# EAGLE design OpenProg-18F2550 (EAGLE 7.2.0)
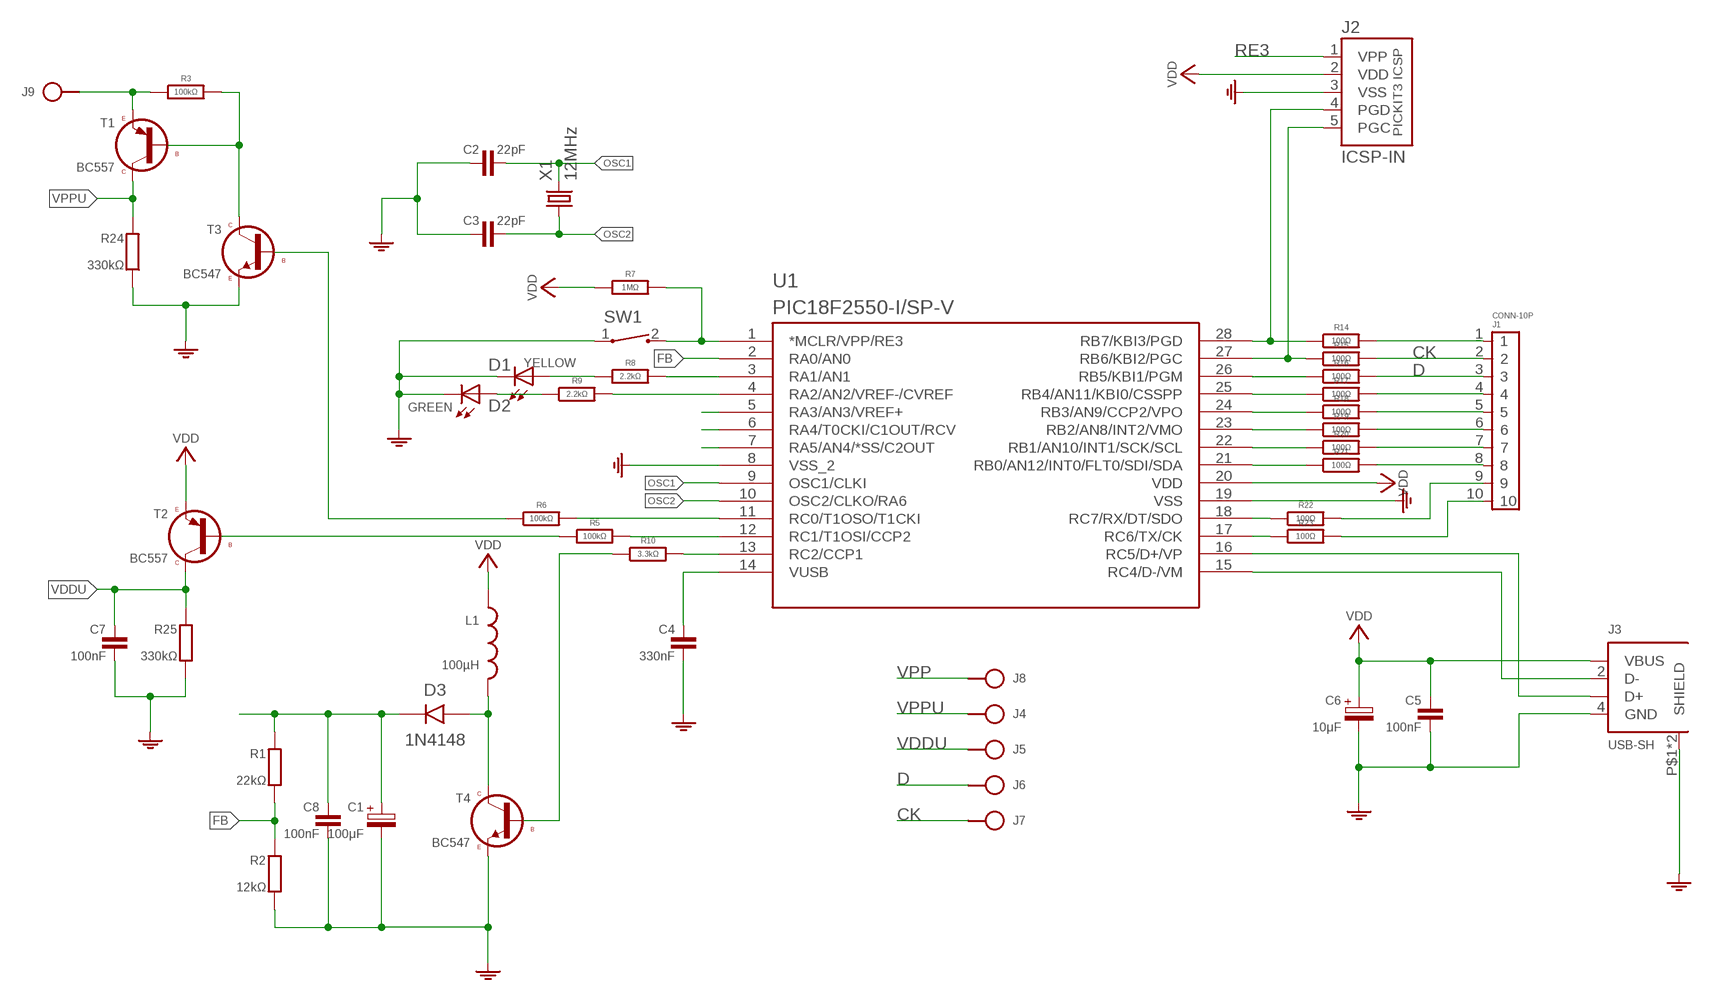
[diagram p0: schematic, sheet 1]

## Parts
C1  100μF  CPOLE5-5  [E5-5]
C2  22pF  C-H025-015X024  [C025-015X024]
C3  22pF  C-H025-015X024  [C025-015X024]
C4  330nF  C050-030X075  [C050-030X075]
C5  100nF  C050-025X075  [C050-025X075]
C6  10μF  CPOLE5-5  [E5-5]
C7  100nF  C050-025X075  [C050-025X075]
C8  100nF  C050-025X075  [C050-025X075]
D1  YELLOW  LED-3MM  [LED_3MM]
D2  GREEN  LED-3MM  [LED_3MM]
D3  1N4148  1N4148-HDO34-7  [DO34-7]
J1  CONN-10P  [CONN-10P]
J2  ICSP-IN  PICKIT3-ICSP-PK3  [PIC-PK3]
J3  USB-SH  [USB-B-PRINT]
J4  HPORT  [SPAD]
J5  HPORT  [SPAD]
J6  HPORT  [SPAD]
J7  HPORT  [SPAD]
J8  HPORT  [SPAD]
J9  HPORT  [SPAD]
L1  100µH  L02/10  [L-03/10V]
R1  22kΩ  R0204/10-V  [0204/10-V]
R2  12kΩ  R0204/10-V  [0204/10-V]
R3  100kΩ  R-H0204/2  [0204/2]
R5  100kΩ  R-H0204/10  [0204/10]
R6  100kΩ  R-H0204/10  [0204/10]
R7  1MΩ  R-H0204/10  [0204/10]
R8  2.2kΩ  R-H0204/10  [0204/10]
R9  2.2kΩ  R-H0204/10  [0204/10]
R10  3.3kΩ  R-H0204/10  [0204/10]
R14  100Ω  R-H0204/10  [0204/10]
R15  100Ω  R-H0204/10  [0204/10]
R16  100Ω  R-H0204/10  [0204/10]
R17  100Ω  R-H0204/10  [0204/10]
R18  100Ω  R-H0204/10  [0204/10]
R19  100Ω  R-H0204/10  [0204/10]
R20  100Ω  R-H0204/10  [0204/10]
R21  100Ω  R-H0204/10  [0204/10]
R22  100Ω  R-H0204/10  [0204/10]
R23  100Ω  R-H0204/10  [0204/10]
R24  330kΩ  R0204/10-V  [0204/10-V]
R25  330kΩ  R0204/10-V  [0204/10-V]
SW1  PUSHBUTTON-P1T  [PB-1P1T]
T1  BC557  BC557CBE-A  [TO92-CBE-A]
T2  BC557  BC557CBE-A  [TO92-CBE-A]
T3  BC547  BC547-A  [TO92-CBE-A]
T4  BC547  BC547-A  [TO92-CBE-A]
U1  PIC18F2550-I/SP-V  [DIL28-3/V]
X1  12MHz  CRYSTALHC49  [HC49]

## Nets
CK: J1.2 J7.1 R15.2
D: J1.3 J6.1 R16.2
FB: R1.2 R2.1 U1.2(RA0/AN0)
GND: C1.- C2.1 C3.1 C4.2 C5.2 C6.- C7.2 C8.2 D1.K(C) D2.K(C) J2.3(VSS) J3.4(GND) J3.P$1(SHIELD) J3.P$2(SHIELD) R2.2 R24.2 R25.2 SW1.1 T3.3(E) T4.3(E) U1.8(VSS_2) U1.19(VSS)
N$2: R10.1 T4.2(B)
N$3: U1.5(RA3/AN3/VREF+)
N$4: U1.6(RA4/T0CKI/C1OUT/RCV)
N$5: D3.A L1.2 T4.1(C)
N$6: U1.7(RA5/AN4/*SS/C2OUT)
N$7: R6.1 T3.2(B)
N$11: R3.2 T1.2(B) T3.1(C)
N$12: R5.1 T2.2(B)
N$13: J2.4(PGD) R14.1 U1.28(RB7/KBI3/PGD)
N$15: J2.5(PGC) R15.1 U1.27(RB6/KBI2/PGC)
N$16: R16.1 U1.26(RB5/KBI1/PGM)
N$17: R17.1 U1.25(RB4/AN11/KBI0/CSSPP)
N$18: R18.1 U1.24(RB3/AN9/CCP2/VPO)
N$19: R19.1 U1.23(RB2/AN8/INT2/VMO)
N$20: R20.1 U1.22(RB1/AN10/INT1/SCK/SCL)
N$21: R21.1 U1.21(RB0/AN12/INT0/FLT0/SDI/SDA)
N$22: J1.1 R14.2
N$25: J1.4 R17.2
N$26: J1.5 R18.2
N$27: J1.6 R19.2
N$28: J1.7 R20.2
N$29: J1.8 R21.2
N$30: R22.1 U1.18(RC7/RX/DT/SDO)
N$31: R23.1 U1.17(RC6/TX/CK)
N$32: J1.9 R22.2
N$33: J1.10 R23.2
N$34: J3.3(D+) U1.16(RC5/D+/VP)
N$35: J3.2(D-) U1.15(RC4/D-/VM)
N$36: C4.1 U1.14(VUSB)
N$39: D1.A R8.1
N$40: D2.A R9.1
OSC1: C2.2 U1.9(OSC1/CLKI) X1.2
OSC2: C3.2 U1.10(OSC2/CLKO/RA6) X1.1
RA1: R8.2 U1.3(RA1/AN1)
RA2: R9.2 U1.4(RA2/AN2/VREF-/CVREF)
RC0: R6.2 U1.11(RC0/T1OSO/T1CKI)
RC1: R5.2 U1.12(RC1/T1OSI/CCP2)
RC2: R10.2 U1.13(RC2/CCP1)
RE3: J2.1(VPP) R7.2 SW1.2 U1.1(*MCLR/VPP/RE3)
VCC: C5.1 C6.+ J2.2(VDD) J3.1(VBUS) L1.1 R7.1 T2.3(E) U1.20(VDD) ; supply symbol labelled VDD
VDDU: C7.1 J5.1 R25.1 T2.1(C)
VPP: C1.+ C8.1 D3.C J8.1 R1.1
VPP2: J9.1 R3.1 T1.3(E)
VPPU: J4.1 R24.1 T1.1(C)

## Library data of the parts
C1 C6 = c:CPOL: POLARIZED CAPACITOR, European symbol
C2 C3 = c:C-H
C4 C5 C7 C8 = c:C: CAPACITOR, European symbol
D1 D2 = d:LED
D3 = d:1N4148-H
J1 = pinconn:CONN-10P
J2 = pinconn:PICKIT3-ICSP
J3 = usb:USB-SH
J4-J9 = pad:HPORT: Conrad Connectors Created by librarian@cadsoft.de
L1 = l:L: Potentiometers Beckman, Copal, Piher, Spectrol, Schukat Created by librarian@cadsoft.de
R1 R2 R24 R25 = r:R: RESISTOR, European symbol
R3 R5-R10 R14-R23 = r:R-H
SW1 = sw:PUSHBUTTON
T1 T2 = t:BC557
T3 T4 = t:BC547
U1 = mcu:PIC18F2550-I/SP
X1 = q:CRYSTAL

## Board
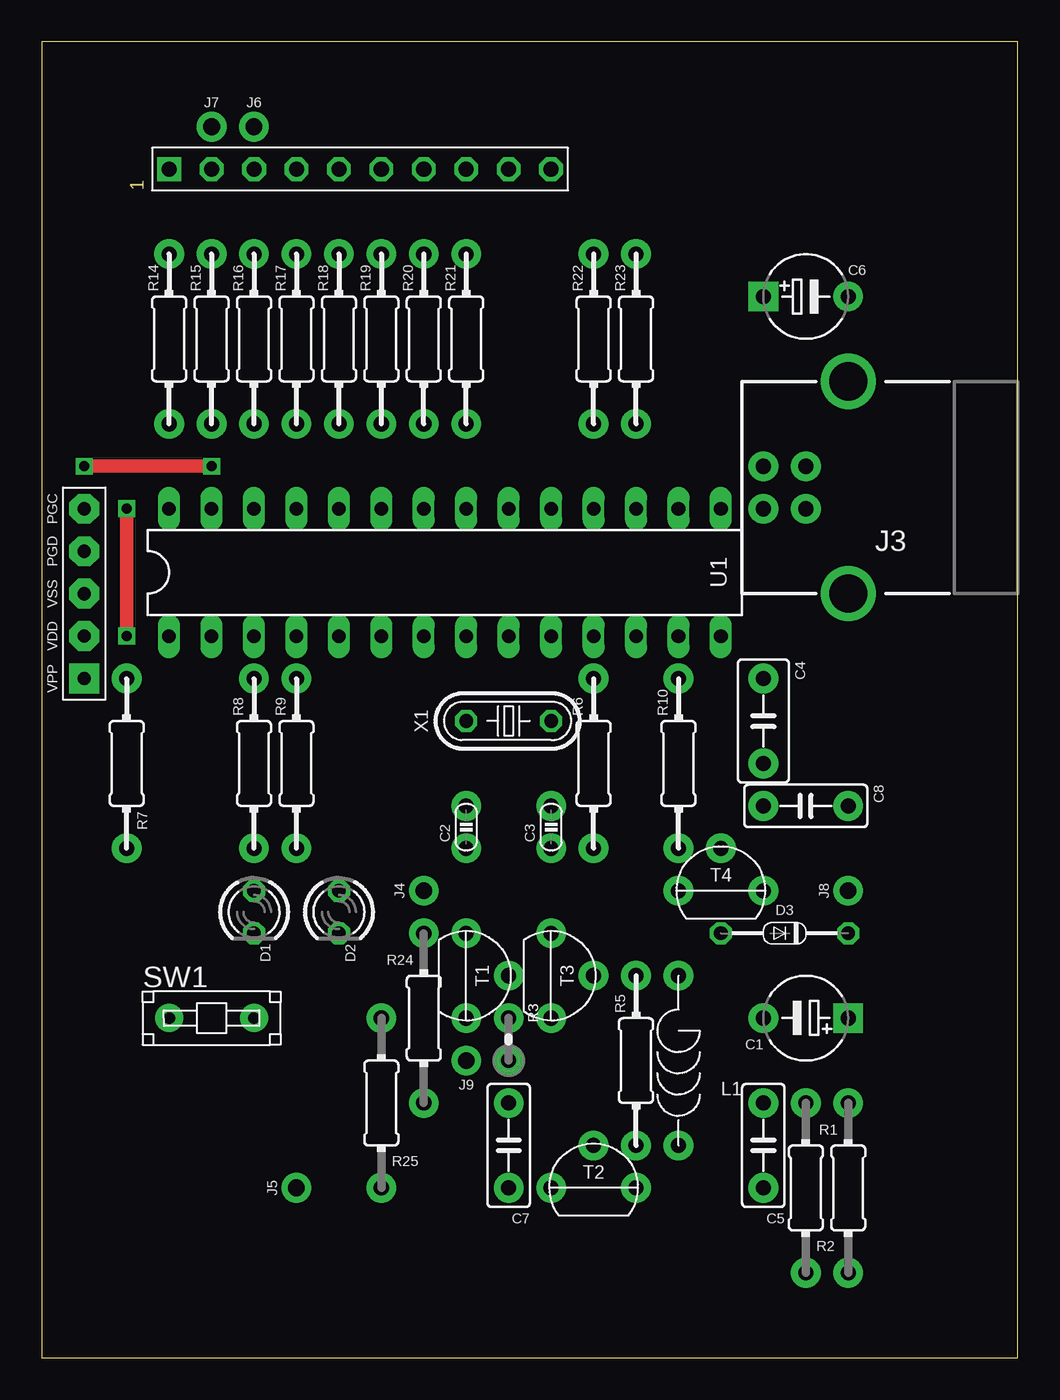
[diagram p1: board, top side]
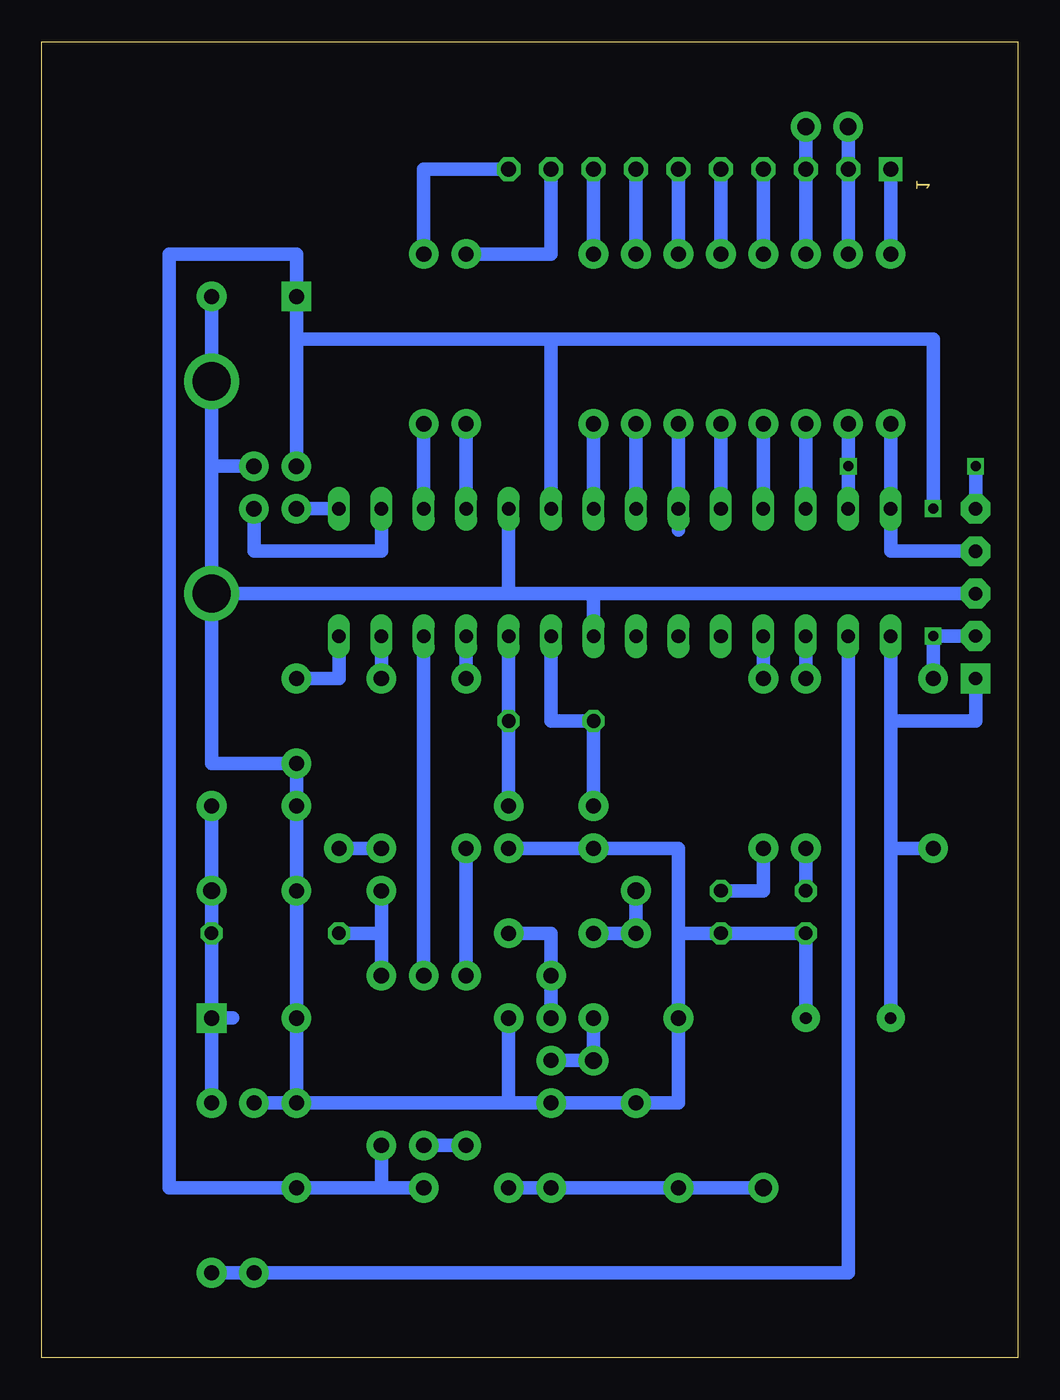
[diagram p2: board, bottom side, seen from below]

Size 58.42 x 78.74 mm. Coordinates in mm from the lower left corner, seen from the top.
Outline: 58.42,0 58.42,78.74 0,78.74 0,0 58.42,0
Copper layers (1*16): Top 0.035mm / dielectric 1.5mm / Bottom 0.035mm
Design rules "default": minimum track width 10mil, minimum drill 24mil, track to track 8mil, track to pad 8mil, pad to pad 8mil, via to via 8mil, smd to smd 8mil, copper to edge 40mil, drill to drill 8mil, minimum pad ring 10mil, minimum via ring 8mil, stop-mask expansion 4mil, vias tented up to drill 0mil, thermal gap 10mil

### Footprints (pad centres in the part's own frame; a part is rotated, then mirrored left to right if it is on the bottom)
E5-5 = drill 0.9 pad 1.778 square: + -2.54,0 | drill 0.9 pad 1.778: - 2.54,0
C025-015X024 = drill 0.9 pad 1.778: 1 -1.27,0; 2 1.27,0
C050-030X075 = drill 0.9 pad 1.778: 1 -2.54,0; 2 2.54,0
C050-025X075 = drill 0.9 pad 1.778: 1 2.54,0; 2 -2.54,0
LED_3MM = drill 0.813 octagon: A -1.27,0; K 1.27,0
DO34-7 = drill 0.813 octagon: A -3.81,0; C 3.81,0
CONN-10P = drill 0.9 pad 1.422 square: 1 -10.16,0 | drill 0.9 pad 1.422 octagon: 2 -7.62,0; 3 -5.08,0; 4 -2.54,0; 5 0,0; 6 2.54,0; 7 5.08,0; 8 7.62,0; 9 10.16,0; 10 12.7,0
PIC-PK3 = drill 0.8 pad 1.778 square: 1 -5.08,0 | drill 0.8 pad 1.778 octagon: 2 -2.54,0; 3 0,0; 4 2.54,0; 5 5.08,0
USB-B-PRINT = drill 0.914 pad 1.778: 1 0,6.35; 2 -2.54,6.35; 3 -2.54,3.81; 4 0,3.81 | drill 2.286: P$1 5.08,1.27; P$2 -7.62,1.27
SPAD = drill 1 pad 1.778: 1 0,0
L-03/10V = drill 0.9 pad 1.778: 1 0,5.08; 2 0,-5.08
0204/10-V = drill 0.9 pad 1.778: 1 0,5.08; 2 0,-5.08
0204/2 = drill 0.9 pad 1.778: 1 1.27,0; 2 -1.27,0
0204/10 = drill 0.9 pad 1.778: 1 -5.08,0; 2 5.08,0
PB-1P1T = drill 0.7 pad 1.676: 1 2.54,0; 2 -2.54,0
TO92-CBE-A = drill 0.9 pad 1.778: 1 0,2.54; 2 2.54,0; 3 0,-2.54
DIL28-3/V = drill 0.813 long: 1 -3.81,16.51; 2 -3.81,13.97; 3 -3.81,11.43; 4 -3.81,8.89; 5 -3.81,6.35; 6 -3.81,3.81; 7 -3.81,1.27; 8 -3.81,-1.27; 9 -3.81,-3.81; 10 -3.81,-6.35; 11 -3.81,-8.89; 12 -3.81,-11.43; 13 -3.81,-13.97; 14 -3.81,-16.51; 15 3.81,-16.51; 16 3.81,-13.97; 17 3.81,-11.43; 18 3.81,-8.89; 19 3.81,-6.35; 20 3.81,-3.81; 21 3.81,-1.27; 22 3.81,1.27; 23 3.81,3.81; 24 3.81,6.35; 25 3.81,8.89; 26 3.81,11.43; 27 3.81,13.97; 28 3.81,16.51
HC49 = drill 0.813 octagon: 1 0,-2.54; 2 0,2.54

### Placement (x,y rotation side)
C1  45.72,20.32 180 top
C2  25.4,31.75 90 top
C3  30.48,31.75 90 top
C4  43.18,38.1 270 top
C5  43.18,12.7 270 top
C6  45.72,63.5 0 top
C7  27.94,12.7 270 top
C8  45.72,33.02 0 top
D1  12.7,26.67 270 top
D2  17.78,26.67 270 top
D3  44.45,25.4 0 top
J1  17.78,71.12 0 top
J2  2.54,45.72 90 top
J3  49.53,53.34 90 top
J4  22.86,27.94 0 top
J5  15.24,10.16 0 top
J6  12.7,73.66 270 top
J7  10.16,73.66 270 top
J8  48.26,27.94 0 top
J9  25.4,17.78 90 top
L1  38.1,17.78 180 top
R1  48.26,10.16 0 top
R2  45.72,10.16 180 top
R3  27.94,19.05 270 top
R5  35.56,17.78 90 top
R6  33.02,35.56 90 top
R7  5.08,35.56 270 top
R8  12.7,35.56 90 top
R9  15.24,35.56 90 top
R10  38.1,35.56 90 top
R14  7.62,60.96 90 top
R15  10.16,60.96 90 top
R16  12.7,60.96 90 top
R17  15.24,60.96 90 top
R18  17.78,60.96 90 top
R19  20.32,60.96 90 top
R20  22.86,60.96 90 top
R21  25.4,60.96 90 top
R22  33.02,60.96 90 top
R23  35.56,60.96 90 top
R24  22.86,20.32 0 top
R25  20.32,15.24 180 top
SW1  10.16,20.32 0 top
T1  25.4,22.86 0 top
T2  33.02,10.16 90 top
T3  30.48,22.86 0 top
T4  40.64,27.94 90 top
U1  24.13,46.99 90 top
X1  27.94,38.1 90 top

### Tracks (layer width: path | path; a pad name or v marks a point on that pad's centre or on a via)
CK
  Bottom 0.813: R15.2 J1.2 J7.1
D
  Bottom 0.813: R16.2 J1.3 J6.1
FB
  Bottom 0.813: U1.2 10.16,5.08 R2.1 R1.2
GND
  Bottom 0.813: C6.- J3.P$1 48.26,53.34 | J3.4 48.26,53.34 | 48.26,53.34 J3.P$2 | U1.19 30.48,45.72 | 30.48,45.72 25.4,45.72 | C3.1 C2.1 20.32,30.48 20.32,25.4 | 30.48,15.24 C7.2 R24.2 20.32,15.24 R25.2 20.32,25.4 | 30.48,15.24 C5.2 | R2.2 C5.2 | C5.2 C1.- T4.3 C8.2 C4.2 48.26,35.56 J3.P$2 | SW1.1 D1.K D2.K 20.32,25.4 | T3.3 30.48,15.24 | 30.48,45.72 J3.P$2 | J2.3 25.4,45.72 | 25.4,45.72 U1.8
N$2
  Bottom 0.813: R10.1 T4.2
N$5
  Bottom 0.813: D3.A 38.1,25.4 | L1.2 38.1,25.4 | 38.1,25.4 T4.1
N$7
  Bottom 0.813: T3.2 R6.1
N$11
  Bottom 0.813: T3.1 27.94,25.4 T1.2 R3.2
N$12
  Bottom 0.813: R5.1 T2.2
N$13
  Bottom 0.813: R14.1 U1.28 7.62,48.26 J2.4
N$15  (via drill 0.6)
  Top 0.813: v10.16,53.34 v2.54,53.34
  Bottom 0.813: R15.1 v10.16,53.34 U1.27 | v2.54,53.34 J2.5
N$16
  Bottom 0.813: U1.26 R16.1
N$17
  Bottom 0.813: R17.1 U1.25
N$18
  Bottom 0.813: U1.24 R18.1
N$19
  Bottom 0.813: R19.1 U1.23 20.32,49.53
N$20
  Bottom 0.813: U1.22 R20.1
N$21
  Bottom 0.813: U1.21 R21.1
N$22
  Bottom 0.813: R14.2 J1.1
N$25
  Bottom 0.813: J1.4 R17.2
N$26
  Bottom 0.813: R18.2 J1.5
N$27
  Bottom 0.813: R19.2 J1.6
N$28
  Bottom 0.813: J1.7 R20.2
N$29
  Bottom 0.813: R21.2 J1.8
N$30
  Bottom 0.813: U1.18 R22.1
N$31
  Bottom 0.813: R23.1 U1.17
N$32
  Bottom 0.813: R22.2 27.94,66.04 J1.9
N$33
  Bottom 0.813: R23.2 35.56,71.12 J1.10
N$34
  Bottom 0.813: U1.16 38.1,48.26 45.72,48.26 J3.3
N$35
  Bottom 0.813: J3.2 U1.15
N$36
  Bottom 0.813: U1.14 40.64,40.64 C4.1
N$39
  Bottom 0.813: R8.1 D1.A
N$40
  Bottom 0.813: D2.A 15.24,27.94 R9.1
OSC1
  Bottom 0.813: U1.9 27.94,38.1 X1.2 C2.2
OSC2
  Bottom 0.813: C3.2 X1.1 U1.10
RA1
  Bottom 0.813: R8.2 U1.3
RA2
  Bottom 0.813: U1.4 R9.2
RC0
  Bottom 0.813: R6.2 U1.11
RC1
  Bottom 0.813: U1.12 R5.2
RC2
  Bottom 0.813: R10.2 U1.13
RE3
  Bottom 0.813: SW1.2 7.62,30.48 | R7.2 7.62,30.48 | 7.62,30.48 7.62,38.1 | U1.1 7.62,38.1 | 7.62,38.1 2.54,38.1 J2.1
VCC  (via drill 0.6)
  Top 0.813: v5.08,50.8 v5.08,43.18
  Bottom 0.813: C6.+ 43.18,60.96 27.94,60.96 | J3.1 C6.+ | C6.+ 43.18,66.04 50.8,66.04 50.8,10.16 C5.1 38.1,10.16 | 38.1,10.16 L1.1 | 38.1,10.16 T2.3 | U1.20 27.94,60.96 | 27.94,60.96 5.08,60.96 v5.08,50.8 | R7.1 v5.08,43.18 J2.2
VDDU
  Bottom 0.813: T2.1 C7.1 R25.1 J5.1
VPP
  Bottom 0.813: R1.1 C1.+ | C1.+ D3.C J8.1 C8.1 | 46.99,20.32 C1.+
VPP2
  Bottom 0.813: T1.3 J9.1 R3.1
VPPU
  Bottom 0.813: T1.1 R24.1 J4.1